# Altium project 555_Tube_Supply.PrjPcb
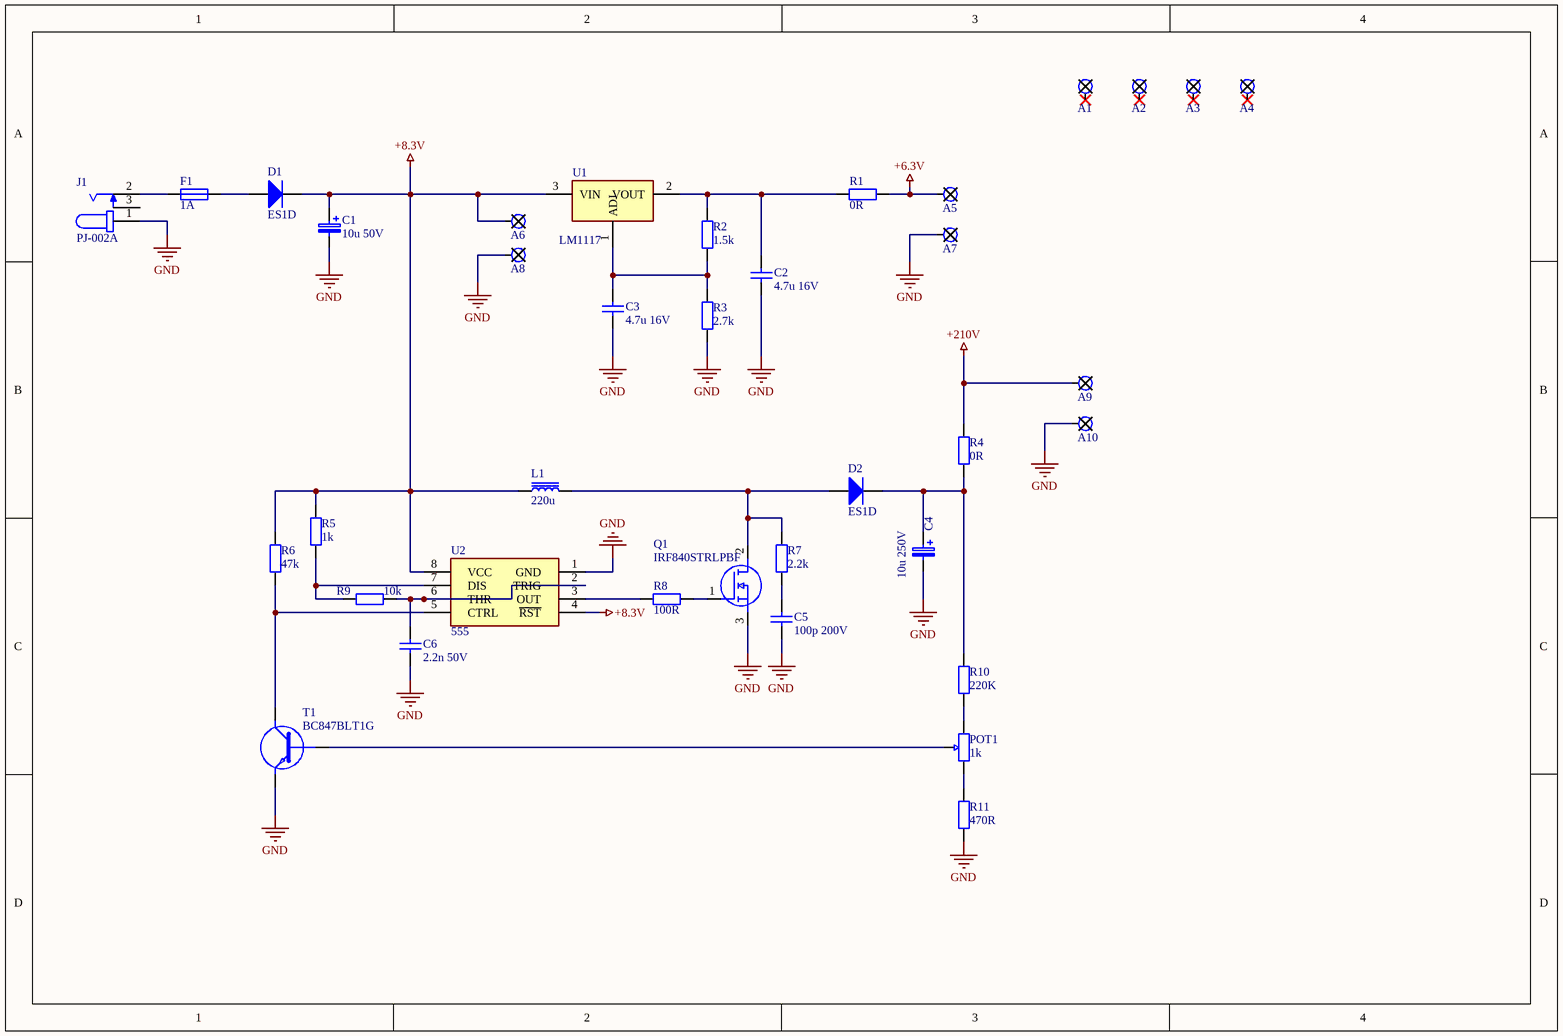
[diagram p0: Power_Supply_HV.SchDoc]
1 sheet, 37 parts. Net scope: global (net labels, ports and power ports of the same name join across sheets).
Board file: Power_Supply_HV.PcbDoc

## Sheet Power_Supply_HV.SchDoc
size A4; SheetNumber: 1; SheetTotal: 1

### Parts
A1  6mm  [HOLE M6]  (value not drawn)
A2  6mm  [HOLE M6]  (value not drawn)
A3  6mm  [HOLE M6]  (value not drawn)
A4  6mm  [HOLE M6]  (value not drawn)
A5  3mm  [HOLE M3]  (value not drawn)
A6  3mm  [HOLE M3]  (value not drawn)
A7  3mm  [HOLE M3]  (value not drawn)
A8  3mm  [HOLE M3]  (value not drawn)
A9  3mm  [HOLE M3]  (value not drawn)
A10  3mm  [HOLE M3]  (value not drawn)
C1  10u 50V  [CAPACITOR 6.3X11MM THT]
C2  4.7u 16V  [CAPACITOR 0805]
C3  4.7u 16V  [CAPACITOR 0805]
C4  10u 250V  [CAPACITOR 10X20MM THT]
C5  100p 200V  [CAPACITOR 1206]
C6  2.2n 50V  [CAPACITOR 0603]
D1  ES1D  [DIODE DO-214AC]
D2  ES1D  [DIODE DO-214AC]
F1  1A  [FUSE 1206]
J1  PJ-002A  [Mechanical CUI_PJ-002A]
L1  220u  [INDUCTOR CDRH127]
POT1  1k  [POTENTIOMETER TC33X]
Q1  IRF840STRLPBF  [TO-263-3]
R1  0R  [RESISTOR 0603]
R2  1.5k  [RESISTOR 0603]
R3  2.7k  [RESISTOR 0603]
R4  0R  [RESISTOR 0603]
R5  1k  [RESISTOR 0603]
R6  47k  [RESISTOR 0603]
R7  2.2k  [RESISTOR 0603]
R8  100R  [RESISTOR 0603]
R9  10k  [RESISTOR 0603]
R10  220K  [RESISTOR 1206]
R11  470R  [RESISTOR 0603]
T1  BC847BLT1G  [SOT23-3]
U1  LM1117  [TO-252]
U2  555  [SOIC-8]

### Nets
+6.3V: A5.1 R1.2
+8.3V: A6.1 C1.1 D1.2 L1.1 R5.2 R6.2 U1.3(VIN) U2.4(~{RST}) U2.8(VCC)
+210V: A9.1 R4.2
GND: A7.1 A8.1 A10.1 C1.2 C2.1 C3.1 C4.2 C5.1 C6.1 J1.1 Q1.3(S) R3.1 R11.1 T1.2(E) U2.1(GND)
NetC2_2: C2.2 R1.1 R2.2 U1.2(VOUT)
NetC3_2: C3.2 R2.1 R3.2 U1.1(ADJ)
NetC4_1: C4.1 D2.2 R4.1 R10.2
NetC5_2: C5.2 R7.1
NetC6_2: C6.2 R9.2 U2.2(TRIG) U2.6(THR)
NetD1_1: D1.1 F1.2
NetD2_1: D2.1 L1.2 Q1.2(D) R7.2
NetF1_1: F1.1 J1.2
NetPOT1_1: POT1.1 R11.2
NetPOT1_2: POT1.2 T1.1(B)
NetPOT1_3: POT1.3 R10.1
NetQ1_1: Q1.1(G) R8.2
NetR5_1: R5.1 R9.1 U2.7(DIS)
NetR6_1: R6.1 T1.3(C) U2.5(CTRL)
NetR8_1: R8.1 U2.3(OUT)

Not connected (* = marked no-connect by the designer): A1 1*; A2 1*; A3 1*; A4 1*; J1 3

### Library data of the parts
A1-A4 = Mechanical M6 Hole: ComponentLink1Description: Datasheet; ComponentLink1URL: -; Manufacturer: -; Manufacturer Part Number: -; Footprint: -; Price 10pcs [$]: -; Supplier: -
A5-A10 = Mechanical M3 Hole: ComponentLink1Description: Datasheet; ComponentLink1URL: -; Manufacturer: -; Manufacturer Part Number: -; Footprint: -; Price 10pcs [$]: -; Supplier: -
C1 = Capacitor 10u 50V 20% Aluminum 6.3x11mm THT: Aluminum Electrolytic Capacitors - Radial Leaded WCAP-ATET 10uF 50V 20% Radial; Manufacturer: Wurth Elektronik; Manufacturer Part Number: 860130673001; ComponentLink1Description: Datasheet; ComponentLink1URL: https://www.mouser.pl/datasheet/2/445/860130673001-3099956.pdf; Footprint: Capacitor 6.3x11mm THT; Price 10pcs [$]: 0.174; Supplier: Mouser
C2 C3 = Capacitor 4.7u 16V 10% X7R 0805: Multilayer Ceramic Capacitors MLCC - SMD/SMT 0805 16VDC 4.7uF 10% X7R; Manufacturer: Taiyo Yuden; Manufacturer Part Number: EMK212B7475KG-T; ComponentLink1Description: Datasheet; ComponentLink1URL: https://www.mouser.pl/datasheet/2/396/mlcc02_e-1307760.pdf; Footprint: Capacitor 0805; Price 10pcs [$]: 0.114; Supplier: Mouser
C4 = Capacitor 10u 250V 20% Aluminum 10x20mm THT: Aluminum Electrolytic Capacitors - Radial Leaded 25V 100uF 105C 6.3x11mm; Manufacturer: Producent; Manufacturer Part Number: PJ2E100MNN1020; ComponentLink1Description: Datasheet; ComponentLink1URL: https://www.tme.eu/Document/f817dd3cf02528febed7ff40ffb84e0e/PART-NUMBER-SYSTEM.pdf; Price 10pcs [$]: 0.215; Supplier: TME
C5 = Capacitor 100p 200V 10% X7R 1206: Multilayer Ceramic Capacitors MLCC - SMD/SMT 200V 100pF X7R 1206 10% AEC-Q200; Manufacturer: KEMET; Manufacturer Part Number: C1206C101K2RACAUTO; ComponentLink1Description: Datasheet; ComponentLink1URL: https://www.mouser.pl/datasheet/2/212/KEM_C1023_X7R_AUTO_SMD-1093309.pdf; Footprint: Capacitor 1206; Price 10pcs [$]: 0.338; Supplier: MOUSER
C6 = Capacitor 2.2n 50V 10% X7R 0603: Multilayer Ceramic Capacitors MLCC - SMD/SMT 0603 50VDC 2200pF 10% X7R AEC-Q200; Manufacturer: Taiyo Yuden; Manufacturer Part Number: UMK107B7222KAHT; ComponentLink1Description: Datasheet; ComponentLink1URL: https://www.mouser.pl/datasheet/2/396/taiyo_yuden_12132018_mlcc11_hq_e-1510082.pdf; Footprint: Capacitor 0603; Price 10pcs [$]: 0.09; Supplier: Mouser
D1 D2 = Diode 200V 1.5W 1A Rectifier Vf 920mV ES1D: Rectifiers 1.0a Rectifier UF Recovery; Manufacturer: onsemi / Fairchild; Manufacturer Part Number: ES1D; Price 10pcs [$]: 0.383; Supplier: Mouser; ComponentLink1Description: Datasheet; ComponentLink1URL: https://www.mouser.pl/datasheet/2/308/ES1D_D-1805714.pdf
F1 = Fuse 1A 1% 1/4W 1206: Surface Mount Fuses 1A 63V TIME DELAY; Manufacturer: Bourns; Manufacturer Part Number: SF-1206HI100M-2; ComponentLink1Description: Datasheet; ComponentLink1URL: https://www.mouser.pl/datasheet/2/54/sf_1206hi_m-1366413.pdf; Footprint: Fuse 1206; Price 10pcs [$]: 0.681; Supplier: Mouser
J1 = Mechanical DC Power Connectors Power Jacks: DC Power Connectors Power Jacks; Manufacturer Part Number: PJ-002A; Manufacturer: https://pl.mouser.com/datasheet/2/670/pj_002a-1778764.pdf; Footprint: 2 mm x 6.5 mm; Type: THT; Datasheet: https://pl.mouser.com/datasheet/2/670/pj_002a-1778764.pdf
L1 = Inductor 220uH 0.95A Shielded 49221C: Power Inductors - SMD 220uH 0.95A Dual wind inductor; Manufacturer: Murata Power Solutions; Manufacturer Part Number: 49221C; ComponentLink1Description: Datasheet; ComponentLink1URL: https://www.mouser.pl/datasheet/2/281/1/kmp_4800-2936266.pdf; Price 10pcs [$]: 1.36; Supplier: Mouser
POT1 = Potentiometer PCB 1k SMD TC33X-1-102E: Trimmer Resistors - SMD TRIMMER-3MM OPEN FRAME; Manufacturer: Bourns; ComponentLink1Description: Datasheet; ComponentLink1URL: https://www.mouser.pl/datasheet/2/54/tc33-778219.pdf; Manufacturer Part Number: TC33X-1-102E; Price 10pcs [$]: 0.275; Supplier: Mouser
Q1 = Transistor N-MOSFET 500V 8A TO-263-3 IRF840STRLPBF: MOSFET 500V N-CH HEXFET D2-PA; Manufacturer: Vishay Semiconductors; Manufacturer Part Number: IRF840STRLPBF; Supplier: Mouser; Price 10pcs [$]: 2.57; ComponentLink1Description: Datasheet; ComponentLink1URL: https://www.mouser.pl/datasheet/2/427/sihf840s-1768741.pdf
R1 R4 = Resistor 0R 1% 1/10W 0603: Thick Film Resistors - SMD 0 Ohms 100 mW 0603 5%; Manufacturer: Yageo; Manufacturer Part Number: RC0603JR-070RL; ComponentLink1Description: Datasheet; ComponentLink1URL: https://www.mouser.pl/datasheet/2/447/PYu_RC_Group_51_RoHS_L_11-1984063.pdf; Footprint: Resistor 0603; Price 10pcs [$]: 0.02; Supplier: Mouser
R2 = Resistor 1.5k 1% 1/10W 0603: Thin Film Resistors - SMD 1/10W 1.5K ohm 1% 50ppm; Manufacturer: Yageo; Manufacturer Part Number: RT0603FRE071K5L; ComponentLink1Description: Datasheet; ComponentLink1URL: https://www.mouser.pl/datasheet/2/447/PYu_RT_1_to_0_01_RoHS_L_12-3003070.pdf; Footprint: Resistor 0603; Price 10pcs [$]: 0.057; Supplier: Mouser
R3 = Resistor 2.7k 1% 1/10W 0603: Thin Film Resistors - SMD 1/10W 2.7K ohm 1% 50ppm; Manufacturer: Yageo; Manufacturer Part Number: RT0603FRE072K7L; ComponentLink1Description: Datasheet; ComponentLink1URL: https://www.mouser.pl/datasheet/2/447/PYu_RT_1_to_0_01_RoHS_L_12-3003070.pdf; Footprint: Resistor 0603; Price 10pcs [$]: 0.057; Supplier: Mouser
R5 = Resistor 1k 1% 1/10W 0603: Thin Film Resistors - SMD 1/10W 1K ohm 1% 50ppm; Manufacturer: Yageo; Manufacturer Part Number: RT0603FRE071KL; ComponentLink1Description: Datasheet; ComponentLink1URL: https://www.mouser.pl/datasheet/2/447/PYu_RT_1_to_0_01_RoHS_L_12-3003070.pdf; Footprint: Resistor 0603; Price 10pcs [$]: 0.057; Supplier: Mouser
R6 = Resistor 47k 1% 1/10W 0603: Thin Film Resistors - SMD 1/10W 47K ohm 1% 50ppm; Manufacturer: Yageo; Manufacturer Part Number: RT0603FRE1347KL; ComponentLink1Description: Datasheet; ComponentLink1URL: https://www.mouser.pl/datasheet/2/447/PYu_RT_1_to_0_01_RoHS_L_12-3003070.pdf; Footprint: Resistor 0603; Price 10pcs [$]: 0.057; Supplier: Mouser
R7 = Resistor 2.2k 1% 1/10W 0603: Thin Film Resistors - SMD 1/10W 2.2K ohm 1% 50ppm; Manufacturer: Yageo; Manufacturer Part Number: RT0603FRE072K2L; ComponentLink1Description: Datasheet; ComponentLink1URL: https://www.mouser.pl/datasheet/2/447/PYu_RT_1_to_0_01_RoHS_L_12-3003070.pdf; Footprint: Resistor 0603; Price 10pcs [$]: 0.057; Supplier: Mouser
R8 = Resistor 100R 1% 1/10W 0603: Thin Film Resistors - SMD 1/10W 100R ohm 1% 50ppm; Manufacturer: Yageo; Manufacturer Part Number: RT0603FRE07100RL; ComponentLink1Description: Datasheet; ComponentLink1URL: https://www.mouser.pl/datasheet/2/447/PYu_RT_1_to_0_01_RoHS_L_12-3003070.pdf; Footprint: Resistor 0603; Price 10pcs [$]: 0.057; Supplier: Mouser
R9 = Resistor 10k 1% 1/10W 0603: Thin Film Resistors - SMD 1/10W 10K ohm 1% 50ppm; Manufacturer: Yageo; Manufacturer Part Number: RT0603FRE1310KL; ComponentLink1Description: Datasheet; ComponentLink1URL: https://www.mouser.pl/datasheet/2/447/PYu_RT_1_to_0_01_RoHS_L_12-3003070.pdf; Footprint: Resistor 0603; Price 10pcs [$]: 0.057; Supplier: Mouser
R10 = Resistor 220k 1% 1/4W 1206: Thin Film Resistors - SMD 1/4W 220 kohm 1% 50ppm; Manufacturer: Yageo; Manufacturer Part Number: RT1206FRE07220KL; ComponentLink1Description: Datasheet; ComponentLink1URL: https://www.mouser.pl/datasheet/2/447/PYu_RT_1_to_0_01_RoHS_L_12-3003070.pdf; Footprint: Resistor 1206; Price 10pcs [$]: 0.125; Supplier: Mouser
R11 = Resistor 470R 1% 1/10W 0603: Thin Film Resistors - SMD 1/10W 470R ohm 1% 50ppm; Manufacturer: Yageo; Manufacturer Part Number: RT0603FRE07470RL; ComponentLink1Description: Datasheet; ComponentLink1URL: https://www.mouser.pl/datasheet/2/447/PYu_RT_1_to_0_01_RoHS_L_12-3003070.pdf; Footprint: Resistor 0603; Price 10pcs [$]: 0.057; Supplier: Mouser
T1 = Transistor NPN 100mA 50V BC847BLT1G: Bipolar Transistors - BJT 100mA 50V NPN; Manufacturer: onsemi; Manufacturer Part Number: BC847BLT1G; Supplier: Mouser; Price 10pcs [$]: 0.094; ComponentLink1Description: Datasheet; ComponentLink1URL: https://www.mouser.pl/datasheet/2/308/BC846ALT1_D-1387679.pdf
U1 = IC LDO ADJ 800mA TO-252 LM1117DT-ADJ: LDO Voltage Regulators 800MA LDO LINEAR REG; Manufacturer: Texas Instruments; Manufacturer Part Number: LM1117DT-ADJ; Price 10pcs [$]: 1.72; Supplier: Mouser; ComponentLink1Description: Datasheet; ComponentLink1URL: https://www.ti.com/general/docs/suppproductinfo.tsp?distId=26&gotoUrl=https://www.ti.com/lit/gpn/lm1117
U2 = IC Timer Module 555 SO-8: Timers & Support Products Precision; Manufacturer: Texas Instruments; Manufacturer Part Number: NE555DR; ComponentLink1Description: Datasheet; ComponentLink1URL: https://www.ti.com/general/docs/suppproductinfo.tsp?distId=26&gotoUrl=https://www.ti.com/lit/gpn/se555m; Price 10pcs [$]: 0.196; Supplier: TME